# EAGLE schematic TamaDecoDumper-LPT-1.1 (EAGLE 6.5.0)
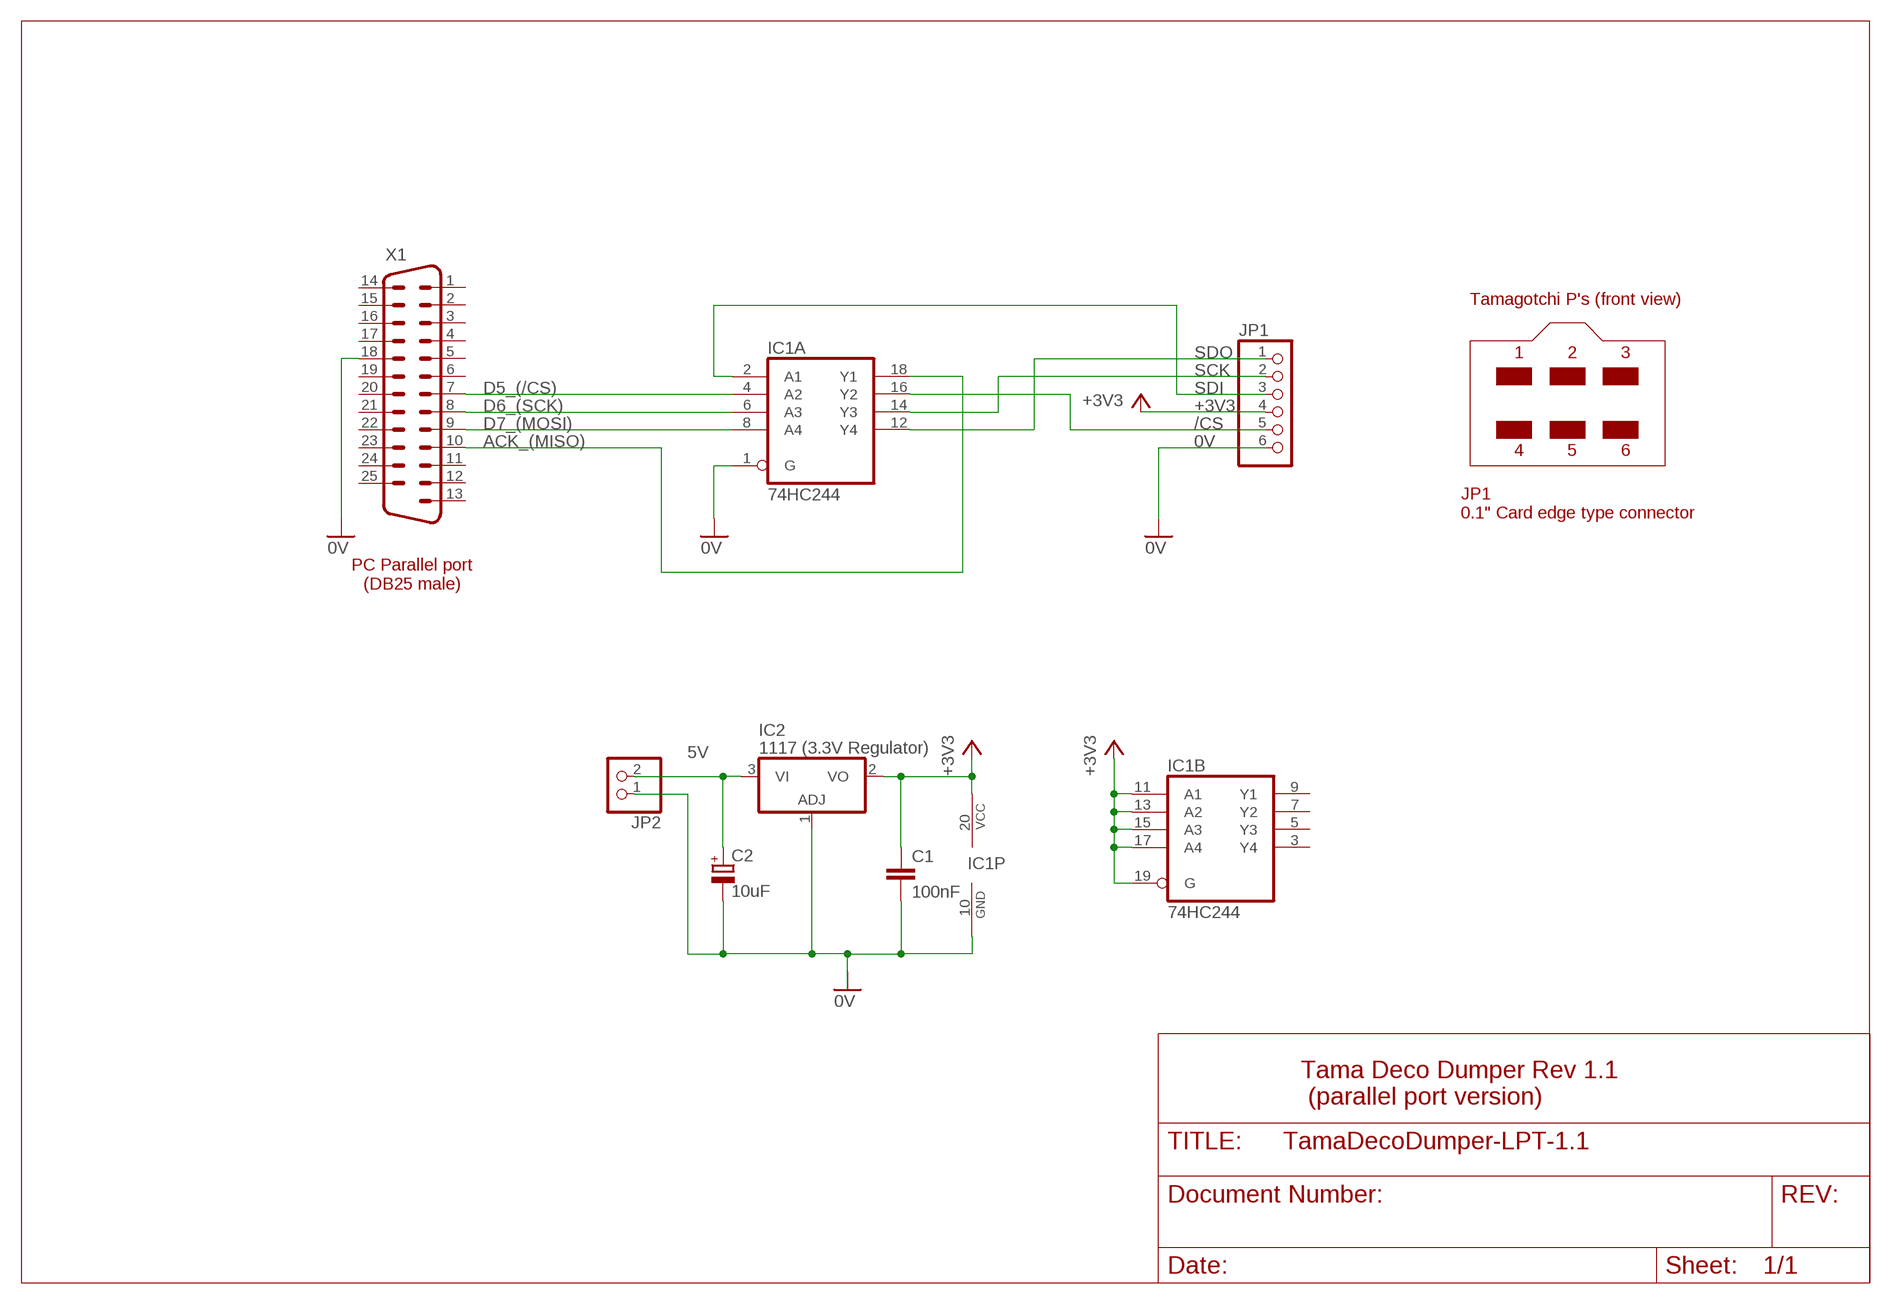
[diagram p0: schematic, sheet 1]

## Parts
C1  100nF  C-EU050-025X075  [C050-025X075]
C2  10uF  CPOL-EUE5-6  [E5-6]
IC1  74HC244  74LS244N  [DIL20]
IC2  1117 (3.3V Regulator)  317T  [TO220H]
JP1  PINHD-1X6  [1X06]
JP2  PINHD-1X2  [1X02]
X1  M25HP  [M25HP]

## Nets
0V: C1.2 C2.- IC1.1(A:G) IC1.10(P:GND) IC2.1(ADJ) JP1.6 JP2.1 X1.18
5V: C2.+ IC2.3(VI) JP2.2
+3V3: C1.1 IC1.11(B:A1) IC1.13(B:A2) IC1.15(B:A3) IC1.17(B:A4) IC1.19(B:G) IC1.20(P:VCC) IC2.2(VO) JP1.4
/CS: IC1.16(A:Y2) JP1.5
ACK_(MISO): IC1.18(A:Y1) X1.10
D5_(/CS): IC1.4(A:A2) X1.7
D6_(SCK): IC1.6(A:A3) X1.8
D7_(MOSI): IC1.8(A:A4) X1.9
SCK: IC1.14(A:Y3) JP1.2
SDI: IC1.2(A:A1) JP1.3
SDO: IC1.12(A:Y4) JP1.1
Unconnected: IC1.3(B:Y4) IC1.5(B:Y3) IC1.7(B:Y2) IC1.9(B:Y1) X1.1 X1.2 X1.3 X1.4 X1.5 X1.6 X1.11 X1.12 X1.13 X1.14 X1.15 X1.16 X1.17 X1.19 X1.20 X1.21 X1.22 X1.23 X1.24 X1.25 X1.G1 X1.G2

## Notes on the sheet
- Tamagotchi P's (front view)
- 1 | 2 | 3
- 4 | 5 | 6
- JP1
  0.1" Card edge type connector
- PC Parallel port
  (DB25 male)
- Tama Deco Dumper Rev 1.1
   (parallel port version)

## Library data of the parts
C1 = rcl:C-EU: CAPACITOR, European symbol
C2 = rcl:CPOL-EU: POLARIZED CAPACITOR, European symbol
IC1 = 74xx-us:74*244: Octal BUFFER and LINE DRIVER, 3-state
IC2 = linear:*317: Positive VOLTAGE REGULATOR
JP1 = pinhead:PINHD-1X6: PIN HEADER
JP2 = pinhead:PINHD-1X2: PIN HEADER
X1 = con-subd:M25HP: SUB-D; OC_FARNELL: unknown; OC_NEWARK: unknown